# Altium schematic sheet MAX_M10M_PINOUT.SchDoc
size B; SheetNumber: 17; SheetTotal: 17
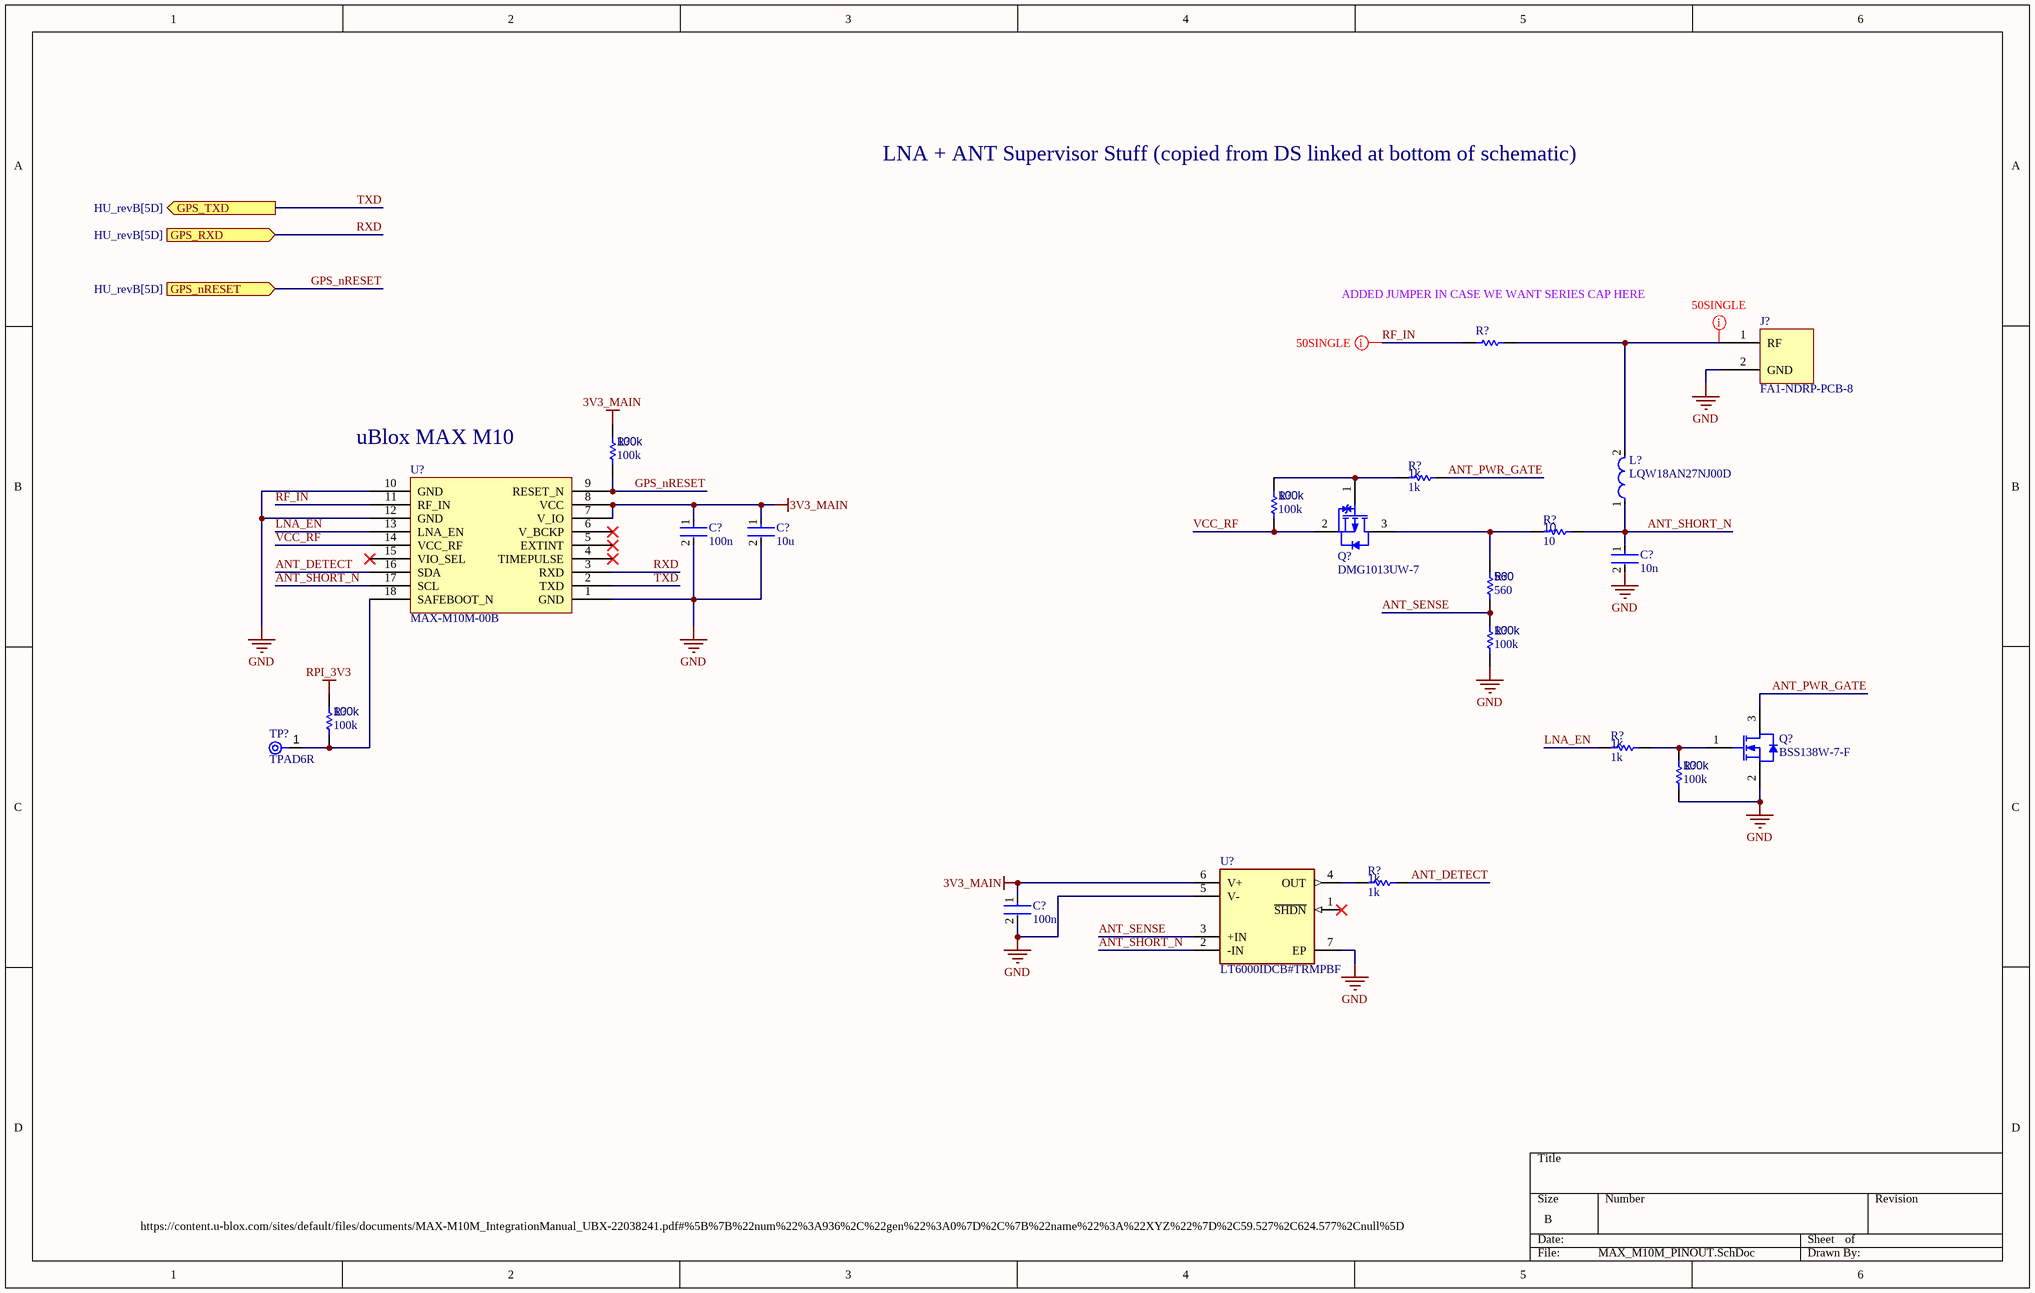
[diagram p0: MAX_M10M_PINOUT.SchDoc]

## Parts
(Parts that share a designator on the sheet are numbered #1, #2 ... from top to bottom, then left to right.)
C?#1  100n  [FP-0402-L_1_0_0_05-W_0_5-IPC_A]
C?#2  10u  [FP-0402-L_1_0_0_05-W_0_5-IPC_A]
C?#3  10n  [FP-0402-L_1_0_0_05-W_0_5-IPC_A]
C?#4  100n  [FP-0402-L_1_0_0_05-W_0_5-IPC_A]
J?  FA1-NDRP-PCB-8  [FA1-NDRP-PCB-8-Footprint-1]
L?  LQW18AN27NJ00D  [FP-LQW18AN_00-MFG]
Q?#1  DMG1013UW-7  [DIOD-SOT323-3_V]
Q?#2  BSS138W-7-F  [DIOD-SOT323-3_V]
R?#1  0402 JUMPER  [RESC1005X40X25ML05T05]  (value not drawn)
R?#2  100k  [R0603B]
R?#3  1k  [R0603B]
R?#4  100k  [R0603B]
R?#5  10  [R0603B]
R?#6  560  [R0603B]
R?#7  100k  [R0603B]
R?#8  100k  [R0603B]
R?#9  1k  [R0603B]
R?#10  100k  [R0603B]
R?#11  1k  [R0603B]
TP?  TPAD6R  [New footprint 1]
U?#1  MAX-M10M-00B  [MAX-M10M-00B-Footprint-1]
U?#2  LT6000IDCB#TRMPBF  [FP-DCB-6-05-08-1715-MFG]

## Ports
GPS_nRESET (in, see HU_revB[5D]), GPS_RXD (in, see HU_revB[5D]), GPS_TXD (out, see HU_revB[5D])

## Nets
3V3_MAIN: C?#1.1 C?#2.1 C?#4.1 R?#2.1 U?#1.7(V_IO) U?#1.8(VCC) U?#2.6(V+)
GND: C?#1.2 C?#2.2 C?#3.2 C?#4.2 J?.2(GND) Q?#2.2(S) R?#7.2 R?#10.2 U?#1.1(GND) U?#1.10(GND) U?#1.12(GND) U?#2.5(V-) U?#2.7(EP)
RPI_3V3: R?#8.1
ANT_DETECT: R?#11.2 U?#1.16(SDA)
ANT_PWR_GATE: Q?#2.3(D) R?#3.2
ANT_SENSE: R?#6.2 R?#7.1 U?#2.3(+IN)
ANT_SHORT_N: C?#3.1 L?.1 R?#5.2 U?#1.17(SCL) U?#2.2(-IN)
GPS_nRESET: R?#2.2 U?#1.9(RESET_N) ; port GPS_nRESET
LNA_EN: R?#9.1 U?#1.13(LNA_EN)
RF_IN: R?#1.1 U?#1.11(RF_IN)
RXD: U?#1.3(RXD) ; port GPS_RXD
TXD: U?#1.2(TXD) ; port GPS_TXD
VCC_RF: Q?#1.2(S) R?#4.2 U?#1.14(VCC_RF)
NetJ?_1: J?.1(RF) L?.2 R?#1.2
NetQ?#1_1: Q?#1.1(G) R?#3.1 R?#4.1
NetQ?#1_3: Q?#1.3(D) R?#5.1 R?#6.1
NetQ?#2_1: Q?#2.1(G) R?#9.2 R?#10.1
NetR?#8_2: R?#8.2 TP?.1(TP) U?#1.18(SAFEBOOT_N)
NetR?#11_1: R?#11.1 U?#2.4(OUT)

Not connected (* = marked no-connect by the designer): U?#1 4(TIMEPULSE)* 5(EXTINT)* 6(V_BCKP)* 15(VIO_SEL)*; U?#2 1(~{SHDN})*

## Layout directives
net class 50SINGLE: NetJ?_1, RF_IN

## Notes on the sheet
- LNA + ANT Supervisor Stuff (copied from DS linked at bottom of schematic)
- (near R?#1) ADDED JUMPER IN CASE WE WANT SERIES CAP HERE
- (near U?#1) uBlox MAX M10
- https://content.u-blox.com/sites/default/files/documents/MAX-M10M_IntegrationManual_UBX-22038241.pdf#%5B%7B%22num%22%3A936%2C%22gen%22%3A0%7D%2C%7B%22name%22%3A%22XYZ%22%7D%2C59.527%2C624.577%2Cnull%5D

## Library data of the parts
C?#1-C?#4 = CMP-001-00058-1: LARGE PADS, 0402 CAP, CHANGE COMMENT TO MATCH REAL P/N; Capacitor Type: Ceramic; Min Operating Temperature: -55°C; Mounting Technology: Surface Mount; Pins: 2; Case/Package: 0402; RoHS Compliant: Yes; Max Operating Temperature: 85°C
  C?#1 C?#4: Value: 100n
  C?#2: Value: 10u
  C?#3: Value: 10n
J? = CMP-002-00054-1: RF F Connector, Male, Board Mount, Solder Terminal, Plug; Connector Type: RF F CONNECTOR; RoHS Compliant: Yes; Mounting Technology: Board
L? = CMP-06042-013840-1: Wire Wound RF Inductor 27nH ±5% 440mA 0.21Ω 0603 (1608); Shielding: Unshielded; Test Frequency: 100MHz; Q Factor: 40; Self Resonant Frequency: 3.7GHz; DC Resistance (DCR): 210mR; Core Material: Non-Magnetic; Depth: 1mm; Min Operating Temperature: -55°C; Package Quantity: 4000; Inductance: 27nH; Case Code (Metric): 1608; Height - Seated (Max): 0.039inch; Resistor Type: Wirewound; Max DC Current: 440mA; Tolerance: 5%; Length: 1.6mm; Mount: Surface Mount; DC Current: 440mA; Packaging: Tape and Reel; Lead Free: Lead Free; Case Code (Imperial): 0603; Current Rating: 440mA; Width: 0.8mm; Max Operating Temperature: 125°C; Termination: SMD/SMT; Weight: 0.000106oz; Radiation Hardening: No; Height: 0.8mm; Case/Package: 0603; Military Standard: Not
Q?#1 = CMP-2000-06170-1: P-Channel Enhancement Mode MOSFET, 310 mW, 20 V, -55 to 150 degC, 3-Pin SOT-323, RoHS, Tape and Reel; Manufacturer: Diodes Inc; Qg Gate Charge: 0.622nC; Drain-Source On Resistance-Max: 750mO; Rated Power Dissipation: 310mW; Drain-to-Source Voltage [Vdss]: 20V; Package Reference: SOT323; Datasheet Version: Rev. 3-2, 09/2013; Package Description: 3-Pin Small Outline Transistor, Body 2 x 1.25 mm, Pitch 0.65 mm; Mounting Technology: SurfaceMount; Manufacturer URL: http://www.diodes.com/; Datasheet URL: http://www.diodes.com/_files/datasheets/ds31861.pdf; Channel Type: P-Channel
Q?#2 = CMP-2000-05968-1: N-Channel Enhancement Mode Mosfet, 50 V, 200 mA, -55 to 150 degC, 6-Pin SOT-323, RoHS, Tape and Reel; Typical Turn-Off Delay Time: 20ns; Number of Channels: 1Channel; Type: EnhancementModeFieldEffectTransistor; Brand: DiodesIncorporated; Vds - Drain-Source Breakdown Voltage: 75V; Vgs - Gate-Source Voltage: 20V; Rds On - Drain-Source Resistance: 1.4Ohms; Transistor Type: 1N-Channel; Configuration: Single; Unit Weight: 0.000212oz; Pd - Power Dissipation: 200mW; Id - Continuous Drain Current: 200mA; Forward Transconductance - Min: 0.1S; Manufacturer URL: http://www.diodes.com/; Series: BSS138; Package Description: 3-Pin Small Outline Transistor, Body 2 x 1.25 mm, Pitch 0.65 mm; Mounting Technology: SurfaceMount; Product Category: MOSFET; RoHS: True; Maximum Operating Temperature: +150C; Height: 1mm; Length: 2.2mm; Technology: Si; Width: 1.35mm; Datasheet URL: http://www.diodes.com/_files/datasheets/ds30206.pdf; Manufacturer: DiodesIncorporated; Package / Case: SOT-323-3; Typical Turn-On Delay Time: 20ns; Transistor Polarity: N-Channel; Factory Pack Quantity: 3000; Packaging: Reel; Product: MOSFETSmallSignal; Datasheet Version: Rev. 11-2, 09/2013; Package Reference: SOT323; Minimum Operating Temperature: -55C; Mounting Style: SMD/SMT; Channel Mode: Enhancement
R?#1 = CMP-009-00118-2: READ THE NAME; Pins: 2; Component Type: Standard; Design Item ID: CMP-009-00206-2; Source: 0402jump.SchLib; Value: 0402 JUMPER
R?#2-R?#11 = CMP-009-00002-14: Resistor
  R?#2 R?#4 R?#7 R?#8 R?#10: Value: 100k
  R?#3 R?#9 R?#11: Value: 1k
  R?#5: Value: 10
  R?#6: Value: 560
TP? = CMP-00025-2: Test Point .6mm
U?#1 = CMP-010-00031-2: Gnss Lcc Rx Mod, Rom, Crystal
U?#2 = CMP-09116-000039-1: IC OPAMP GP 1 CIRCUIT 6DFN; Number of Elements: 1; Power Supply Rejection Ratio (PSRR): 86dB; Output Current per Channel: 10mA; Gain Bandwidth Product: 60kHz; Operating Supply Current: 20uA; Input Bias Current: 12nA; Voltage Gain: 120dB; Max Supply Voltage: 18V; Input Offset Voltage (Vos): 1.2mV; Min Supply Voltage: 1.8V; Slew Rate: 0.018V/µs; Common Mode Rejection Ratio: 68dB; Packaging: Tape and Reel; Mount: Surface Mount; Case/Package: DFN; Max Operating Temperature: 85°C; Number of Pins: 6; Number of Amplifiers: 1; REACH SVHC: No SVHC; Unity Gain Bandwidth Product: 60kHz; Bandwidth: 60kHz; Lead Free: Lead Free; Number of Circuits: 1; Min Operating Temperature: -40°C; Package Quantity: 1